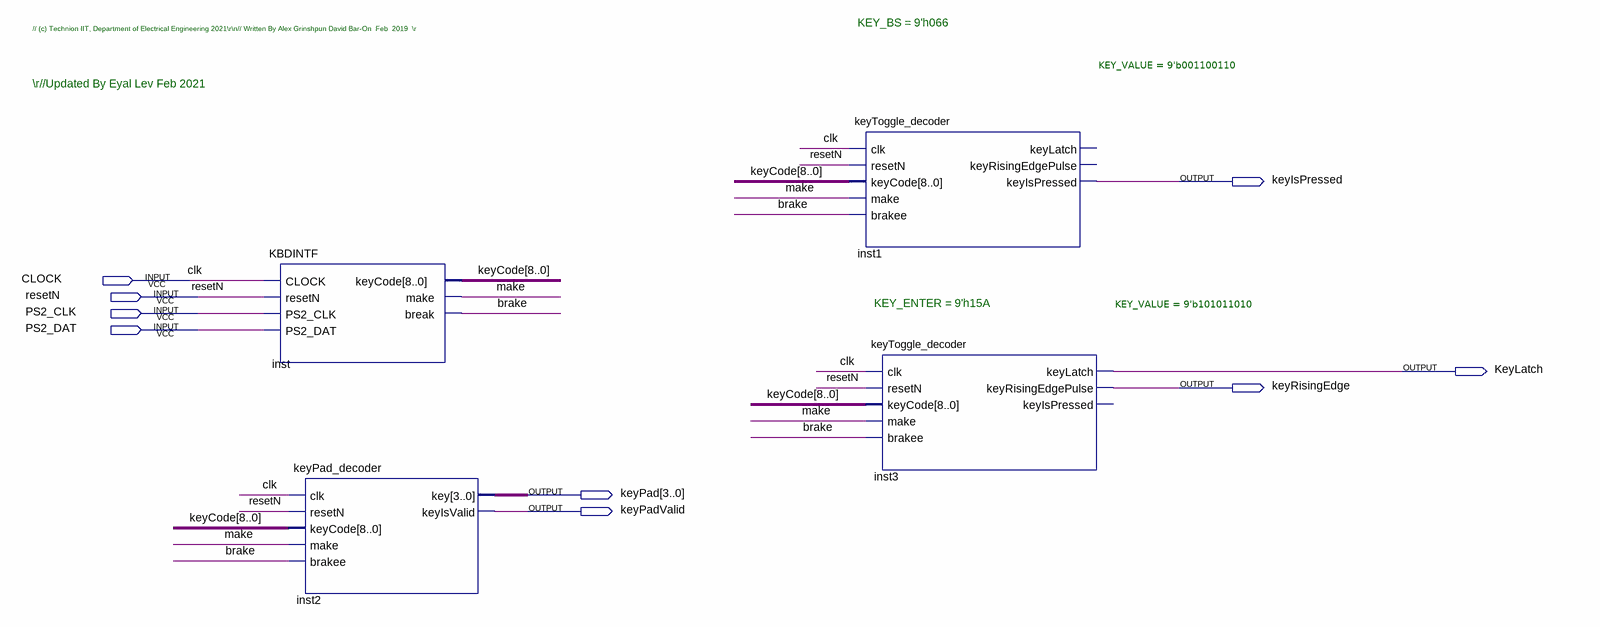
[diagram p0: schematic sheet]
// Quartus schematic KEYBOARD_INTERFACE.bdf as structural Verilog: 4 symbols, 9 pins
module KEYBOARD_INTERFACE (
  input  CLOCK,
  input  resetN,
  input  PS2_CLK,
  input  PS2_DAT,
  output keyIsPressed,
  output KeyLatch,
  output keyRisingEdge,
  output [3:0] keyPad,
  output keyPadValid
);

  wire brake, make;
  wire [8:0] keyCode;

  KBDINTF inst (
    .CLOCK(CLOCK), .resetN(resetN), .PS2_CLK(PS2_CLK), .PS2_DAT(PS2_DAT), .keyCode(keyCode), .make(make),
    .\break (brake));
  keyPad_decoder inst2 (
    .clk(CLOCK), .resetN(resetN), .keyCode(keyCode), .make(make), .brakee(brake), .key(keyPad),
    .keyIsValid(keyPadValid));
  keyToggle_decoder #(.KEY_VALUE(9'b001100110)) inst1 (
    .clk(CLOCK), .resetN(resetN), .keyCode(keyCode), .make(make), .brakee(brake), .keyIsPressed(keyIsPressed));  // open: keyLatch, keyRisingEdgePulse
  keyToggle_decoder #(.KEY_VALUE(9'b101011010)) inst3 (
    .clk(CLOCK), .resetN(resetN), .keyCode(keyCode), .make(make), .brakee(brake), .keyLatch(KeyLatch),
    .keyRisingEdgePulse(keyRisingEdge));  // open: keyIsPressed

  // Other names for the same wires on the sheet: clk = CLOCK

  // Notes on the sheet:
  //   KEY_BS = 9'h066
  //   // (c) Technion IIT, Department of Electrical Engineering 2021\r\n// Written By Alex Grinshpun David Bar-On  Feb  2019  \r
  //   \r//Updated By Eyal Lev Feb 2021
  //   KEY_ENTER = 9'h15A
endmodule
